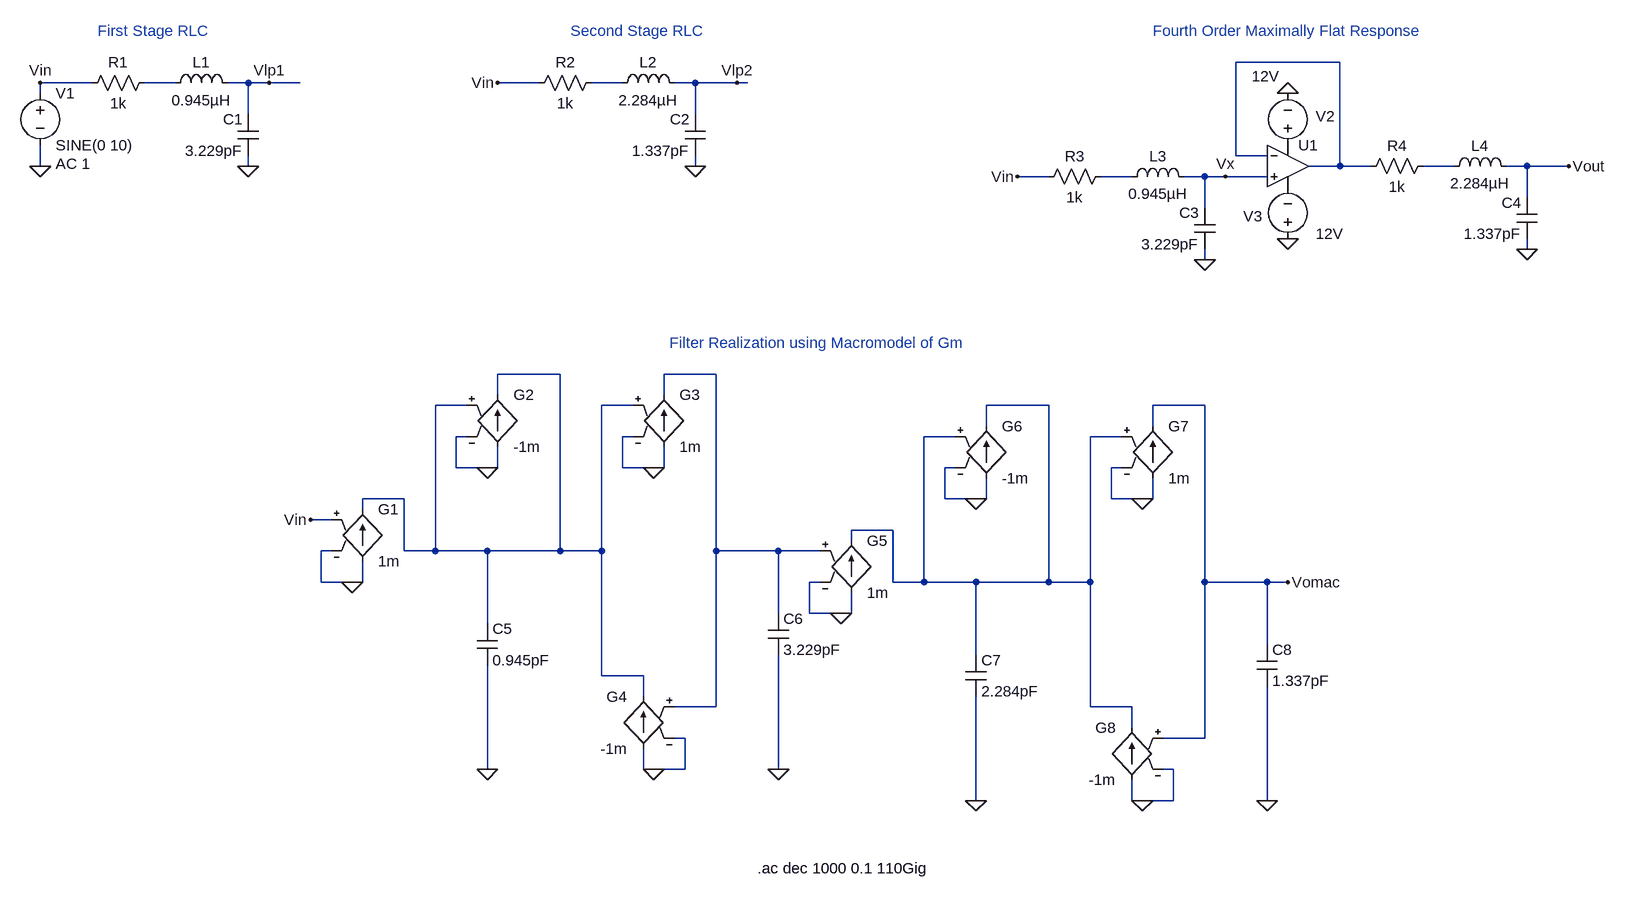
[diagram p0: schematic AFProject_Macromodel_Realization.asc]
AFProject_Macromodel_Realization.asc, the LTspice schematic file:
Version 4
SHEET 1 1800 1992
WIRE 1264 128 1104 128
WIRE -656 160 -736 160
WIRE -528 160 -576 160
WIRE -416 160 -448 160
WIRE -384 160 -416 160
WIRE -336 160 -384 160
WIRE 32 160 -32 160
WIRE 160 160 112 160
WIRE 272 160 240 160
WIRE 336 160 272 160
WIRE 352 160 336 160
WIRE -736 176 -736 160
WIRE -416 208 -416 160
WIRE 272 208 272 160
WIRE 1104 272 1104 128
WIRE 1152 272 1104 272
WIRE -736 288 -736 256
WIRE -416 288 -416 272
WIRE 272 288 272 272
WIRE 1264 288 1264 128
WIRE 1264 288 1216 288
WIRE 1312 288 1264 288
WIRE 1440 288 1392 288
WIRE 1552 288 1520 288
WIRE 1616 288 1552 288
WIRE 816 304 768 304
WIRE 944 304 896 304
WIRE 1056 304 1024 304
WIRE 1088 304 1056 304
WIRE 1152 304 1088 304
WIRE 1552 336 1552 288
WIRE 1056 352 1056 304
WIRE 1552 416 1552 400
WIRE 1056 432 1056 416
WIRE 64 608 -32 608
WIRE 304 608 224 608
WIRE -32 640 -32 608
WIRE 224 640 224 608
WIRE -80 656 -128 656
WIRE 176 656 128 656
WIRE 816 656 720 656
WIRE 1056 656 976 656
WIRE 720 688 720 656
WIRE 976 688 976 656
WIRE -80 704 -96 704
WIRE 176 704 160 704
WIRE 672 704 624 704
WIRE 928 704 880 704
WIRE -96 752 -96 704
WIRE -48 752 -96 752
WIRE -32 752 -32 720
WIRE -32 752 -48 752
WIRE 160 752 160 704
WIRE 208 752 160 752
WIRE 224 752 224 720
WIRE 224 752 208 752
WIRE 672 752 656 752
WIRE 928 752 912 752
WIRE -176 800 -240 800
WIRE 656 800 656 752
WIRE 704 800 656 800
WIRE 720 800 720 768
WIRE 720 800 704 800
WIRE 912 800 912 752
WIRE 960 800 912 800
WIRE 976 800 976 768
WIRE 976 800 960 800
WIRE -240 816 -240 800
WIRE -288 832 -320 832
WIRE 576 848 512 848
WIRE 512 864 512 848
WIRE -288 880 -304 880
WIRE -176 880 -176 800
WIRE -128 880 -128 656
WIRE -128 880 -176 880
WIRE -48 880 -128 880
WIRE 64 880 64 608
WIRE 64 880 -48 880
WIRE 128 880 128 656
WIRE 128 880 64 880
WIRE 304 880 304 608
WIRE 400 880 304 880
WIRE 464 880 400 880
WIRE -304 928 -304 880
WIRE -256 928 -304 928
WIRE -240 928 -240 896
WIRE -240 928 -256 928
WIRE 464 928 448 928
WIRE 576 928 576 848
WIRE 624 928 624 704
WIRE 624 928 576 928
WIRE 704 928 624 928
WIRE 816 928 816 656
WIRE 816 928 704 928
WIRE 880 928 880 704
WIRE 880 928 816 928
WIRE 1056 928 1056 656
WIRE 1152 928 1056 928
WIRE 1184 928 1152 928
WIRE 400 976 400 880
WIRE 448 976 448 928
WIRE 496 976 448 976
WIRE 512 976 512 944
WIRE 512 976 496 976
WIRE -48 992 -48 880
WIRE 1152 1024 1152 928
WIRE 704 1040 704 928
WIRE 128 1072 128 880
WIRE 192 1072 128 1072
WIRE 192 1104 192 1072
WIRE 304 1120 304 880
WIRE 304 1120 240 1120
WIRE 880 1120 880 928
WIRE 944 1120 880 1120
WIRE 944 1152 944 1120
WIRE 256 1168 240 1168
WIRE 1056 1168 1056 928
WIRE 1056 1168 992 1168
WIRE -48 1216 -48 1056
WIRE 192 1216 192 1184
WIRE 208 1216 192 1216
WIRE 256 1216 256 1168
WIRE 256 1216 208 1216
WIRE 400 1216 400 1040
WIRE 1008 1216 992 1216
WIRE 704 1264 704 1104
WIRE 944 1264 944 1232
WIRE 960 1264 944 1264
WIRE 1008 1264 1008 1216
WIRE 1008 1264 960 1264
WIRE 1152 1264 1152 1088
FLAG -736 288 0
FLAG -416 288 0
FLAG 272 288 0
FLAG -736 160 Vin
FLAG -384 160 Vlp1
FLAG 336 160 Vlp2
FLAG -32 160 Vin
FLAG 1056 432 0
FLAG 1552 416 0
FLAG 1088 304 Vx
FLAG 1184 176 0
FLAG 1184 400 0
FLAG 768 304 Vin
FLAG 1616 288 Vout
FLAG -256 928 0
FLAG -48 752 0
FLAG 208 752 0
FLAG 208 1216 0
FLAG -48 1216 0
FLAG 400 1216 0
FLAG 496 976 0
FLAG 704 800 0
FLAG 960 800 0
FLAG 960 1264 0
FLAG 704 1264 0
FLAG 1152 1264 0
FLAG -320 832 Vin
FLAG 1184 928 Vomac
SYMBOL res -560 144 R90
WINDOW 0 0 56 VBottom 2
WINDOW 3 32 56 VTop 2
SYMATTR InstName R1
SYMATTR Value 1k
SYMBOL cap -400 272 R180
WINDOW 0 24 56 Left 2
WINDOW 3 24 8 Left 2
SYMATTR InstName C1
SYMATTR Value 3.229pF
SYMBOL ind -544 176 R270
WINDOW 0 32 56 VTop 2
WINDOW 3 5 56 VBottom 2
SYMATTR InstName L1
SYMATTR Value 0.945µH
SYMATTR SpiceLine Rser=0
SYMBOL res 128 144 R90
WINDOW 0 0 56 VBottom 2
WINDOW 3 32 56 VTop 2
SYMATTR InstName R2
SYMATTR Value 1k
SYMBOL cap 288 272 R180
WINDOW 0 24 56 Left 2
WINDOW 3 24 8 Left 2
SYMATTR InstName C2
SYMATTR Value 1.337pF
SYMBOL ind 144 176 R270
WINDOW 0 32 56 VTop 2
WINDOW 3 5 56 VBottom 2
SYMATTR InstName L2
SYMATTR Value 2.284µH
SYMATTR SpiceLine Rser=0
SYMBOL voltage -736 160 R0
WINDOW 123 24 124 Left 2
WINDOW 39 0 0 Left 0
SYMATTR Value2 AC 1
SYMATTR InstName V1
SYMATTR Value SINE(0 10)
SYMBOL res 912 288 R90
WINDOW 0 0 56 VBottom 2
WINDOW 3 32 56 VTop 2
SYMATTR InstName R3
SYMATTR Value 1k
SYMBOL cap 1072 416 R180
WINDOW 0 24 56 Left 2
WINDOW 3 24 8 Left 2
SYMATTR InstName C3
SYMATTR Value 3.229pF
SYMBOL ind 928 320 R270
WINDOW 0 32 56 VTop 2
WINDOW 3 5 56 VBottom 2
SYMATTR InstName L3
SYMATTR Value 0.945µH
SYMATTR SpiceLine Rser=0
SYMBOL res 1408 272 R90
WINDOW 0 0 56 VBottom 2
WINDOW 3 32 56 VTop 2
SYMATTR InstName R4
SYMATTR Value 1k
SYMBOL cap 1568 400 R180
WINDOW 0 24 56 Left 2
WINDOW 3 24 8 Left 2
SYMATTR InstName C4
SYMATTR Value 1.337pF
SYMBOL ind 1424 304 R270
WINDOW 0 32 56 VTop 2
WINDOW 3 5 56 VBottom 2
SYMATTR InstName L4
SYMATTR Value 2.284µH
SYMATTR SpiceLine Rser=0
SYMBOL OpAmps\\UniversalOpamp2 1184 288 R0
SYMATTR InstName U1
SYMATTR Value2 Avol=1Meg GBW=10000Gig Slew=10000Gig
SYMATTR SpiceLine2 En=0 Enk=0 In=0 Ink=0 Rin=500Meg Ro=1 Ccm=0.00001pF Cdiff=0.000012p
SYMBOL voltage 1184 272 R180
WINDOW 0 -72 61 Left 2
WINDOW 3 13 122 Left 2
WINDOW 123 0 0 Left 0
WINDOW 39 0 0 Left 0
SYMATTR InstName V2
SYMATTR Value 12V
SYMBOL voltage 1184 416 R180
WINDOW 0 39 51 Left 2
WINDOW 3 -86 24 Left 2
SYMATTR InstName V3
SYMATTR Value 12V
SYMBOL g -240 800 R0
SYMATTR InstName G1
SYMATTR Value 1m
SYMBOL g -32 624 R0
SYMATTR InstName G2
SYMATTR Value -1m
SYMBOL g 224 624 R0
SYMATTR InstName G3
SYMATTR Value 1m
SYMBOL g 192 1088 M0
SYMATTR InstName G4
SYMATTR Value -1m
SYMBOL cap -64 992 R0
SYMATTR InstName C5
SYMATTR Value 0.945pF
SYMBOL cap 384 976 R0
SYMATTR InstName C6
SYMATTR Value 3.229pF
SYMBOL g 512 848 R0
SYMATTR InstName G5
SYMATTR Value 1m
SYMBOL g 720 672 R0
SYMATTR InstName G6
SYMATTR Value -1m
SYMBOL g 976 672 R0
SYMATTR InstName G7
SYMATTR Value 1m
SYMBOL g 944 1136 M0
SYMATTR InstName G8
SYMATTR Value -1m
SYMBOL cap 688 1040 R0
SYMATTR InstName C7
SYMATTR Value 2.284pF
SYMBOL cap 1136 1024 R0
SYMATTR InstName C8
SYMATTR Value 1.337pF
TEXT -648 80 Left 2 ;First Stage RLC
TEXT 80 80 Left 2 ;Second Stage RLC
TEXT 368 1368 Left 2 !.ac dec 1000 0.1 110Gig
TEXT 976 80 Left 2 ;Fourth Order Maximally Flat Response
TEXT 232 560 Left 2 ;Filter Realization using Macromodel of Gm

The netlist it stands for:
* AFProject_Macromodel_Realization.asc
R1 N002 Vin 1k
C1 0 Vlp1 3.229pF
L1 N002 Vlp1 0.945µH Rser=0
R2 N003 Vin 1k
C2 0 Vlp2 1.337pF
L2 N003 Vlp2 2.284µH Rser=0
V1 Vin 0 SINE(0 10) AC 1
R3 N005 Vin 1k
C3 0 Vx 3.229pF
L3 N005 Vx 0.945µH Rser=0
R4 N004 N001 1k
C4 0 Vout 1.337pF
L4 N004 Vout 2.284µH Rser=0
XU1 Vx N001 P001 P002 N001 level.2 Avol=1Meg GBW=10000Gig Slew=10000Gig ilimit=25m rail=0 Vos=0 phimargin=45 En=0 Enk=0 In=0 Ink=0 Rin=500Meg Ro=1 Ccm=0.00001pF Cdiff=0.000012p  ; pins IN+ IN- V+ V- OUT
V2 P001 0 12V
V3 0 P002 12V
G1 0 N006 Vin 0 1m
G2 0 N006 N006 0 -1m
G3 0 N007 N006 0 1m
G4 0 N006 N007 0 -1m
C5 N006 0 0.945pF
C6 N007 0 3.229pF
G5 0 N008 N007 0 1m
G6 0 N008 N008 0 -1m
G7 0 Vomac N008 0 1m
G8 0 N008 Vomac 0 -1m
C7 N008 0 2.284pF
C8 Vomac 0 1.337pF
* First Stage RLC
* Second Stage RLC
.ac dec 1000 0.1 110Gig
* Fourth Order Maximally Flat Response
* Filter Realization using Macromodel of Gm
.lib UniversalOpamps2.sub
.backanno
.end